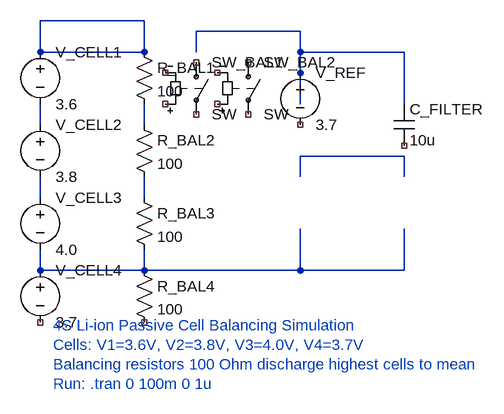
[diagram p0: schematic cell_balancing_full.asc]
cell_balancing_full.asc, the LTspice schematic file:
Version 4
SHEET 1 2000 1400
WIRE 80 80 80 48
WIRE 80 80 240 80
WIRE 240 80 240 48
WIRE 80 192 80 160
WIRE 240 192 240 160
WIRE 80 304 80 272
WIRE 240 304 240 272
WIRE 80 416 80 384
WIRE 240 416 240 384
WIRE 80 48 80 32
WIRE 240 48 240 32
WIRE 80 32 160 32
WIRE 160 32 240 32
WIRE 480 160 480 80
WIRE 480 80 640 80
WIRE 640 80 640 160
WIRE 480 272 480 240
WIRE 640 272 640 240
WIRE 480 240 640 240
WIRE 80 416 480 416
WIRE 480 416 480 352
WIRE 640 416 640 352
WIRE 480 416 640 416
WIRE 320 80 320 48
WIRE 320 48 400 48
WIRE 400 48 480 48
WIRE 480 48 480 80
SYMBOL voltage 80 64 R0
SYMATTR InstName V_CELL1
SYMATTR Value 3.6
SYMATTR SpiceLine Rint=0.01
SYMBOL voltage 80 176 R0
SYMATTR InstName V_CELL2
SYMATTR Value 3.8
SYMATTR SpiceLine Rint=0.01
SYMBOL voltage 80 288 R0
SYMATTR InstName V_CELL3
SYMATTR Value 4.0
SYMATTR SpiceLine Rint=0.01
SYMBOL voltage 80 400 R0
SYMATTR InstName V_CELL4
SYMATTR Value 3.7
SYMATTR SpiceLine Rint=0.01
SYMBOL res 224 64 R0
SYMATTR InstName R_BAL1
SYMATTR Value 100
SYMBOL res 224 176 R0
SYMATTR InstName R_BAL2
SYMATTR Value 100
SYMBOL res 224 288 R0
SYMATTR InstName R_BAL3
SYMATTR Value 100
SYMBOL res 224 400 R0
SYMATTR InstName R_BAL4
SYMATTR Value 100
SYMBOL sw 320 80 R0
SYMATTR InstName SW_BAL1
SYMATTR Value SW
SYMBOL sw 400 80 R0
SYMATTR InstName SW_BAL2
SYMATTR Value SW
SYMBOL voltage 480 96 R0
SYMATTR InstName V_REF
SYMATTR Value 3.7
SYMBOL cap 624 160 R0
SYMATTR InstName C_FILTER
SYMATTR Value 10u
TEXT 100 500 Left 2 ;4S Li-ion Passive Cell Balancing Simulation
TEXT 100 530 Left 2 ;Cells: V1=3.6V, V2=3.8V, V3=4.0V, V4=3.7V
TEXT 100 560 Left 2 ;Balancing resistors 100 Ohm discharge highest cells to mean
TEXT 100 590 Left 2 ;Run: .tran 0 100m 0 1u
.tran 0 200m 0 10u
.meas TRAN Vmax MAX V(n001) FROM 0 TO 200m
.meas TRAN Vmin MIN V(n001) FROM 0 TO 200m
.backanno
.end

The netlist it stands for:
* cell_balancing_full.asc
V_CELL1 N001 N002 3.6 Rint=0.01
V_CELL2 N002 N004 3.8 Rint=0.01
V_CELL3 N004 N006 4.0 Rint=0.01
V_CELL4 N006 NC_01 3.7 Rint=0.01
R_BAL1 N001 N003 100
R_BAL2 N003 N005 100
R_BAL3 N005 N006 100
R_BAL4 N006 NC_02 100
SW_BAL1 NC_03 NC_04 NC_05 NC_06 SW
SW_BAL2 NC_07 NC_08 NC_09 NC_10 SW
V_REF N007 NC_11 3.7
C_FILTER N007 NC_12 10u
* 4S Li-ion Passive Cell Balancing Simulation
* Cells: V1=3.6V, V2=3.8V, V3=4.0V, V4=3.7V
* Balancing resistors 100 Ohm discharge highest cells to mean
* Run: .tran 0 100m 0 1u
.backanno
.end